# EAGLE schematic schematic (EAGLE 7.5.0)
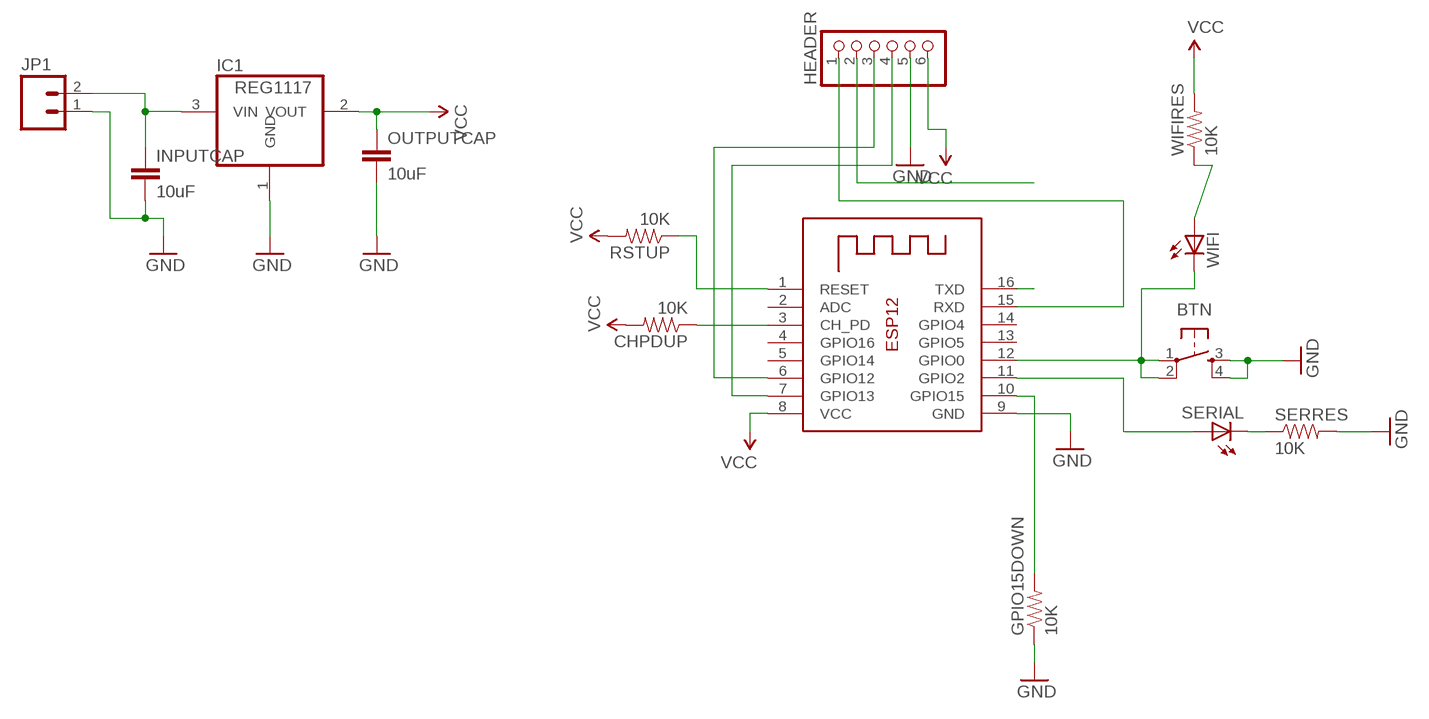
[diagram p0: schematic, sheet 1]

## Parts
BTN  TAC_SWITCHPTH  [TACTILE-PTH]
CHPDUP  10K  RESISTOR0805-RES  [0805]
GPIO15DOWN  10K  RESISTOR0805-RES  [0805]
HEADER  PINHD-1X6  [1X06]
IC1  REG1117  [SOT223]
INPUTCAP  10uF  CAP0805  [0805]
JP1  M02LOCK  [1X02_LOCK]
OUTPUTCAP  10uF  CAP0805  [0805]
RSTUP  10K  RESISTOR0805-RES  [0805]
SERIAL  LEDCHIPLED_0805  [CHIPLED_0805]
SERRES  10K  RESISTOR0805-RES  [0805]
WIFI  LEDCHIPLED_0805  [CHIPLED_0805]
WIFIRES  10K  RESISTOR0805-RES  [0805]
X1  ESP-12  [ESP-12]

## Nets
GND: BTN.3 BTN.4 GPIO15DOWN.1 HEADER.5 IC1.1(GND) INPUTCAP.2 JP1.1 OUTPUTCAP.2 SERRES.2 X1.9(GND)
N$1: HEADER.1 X1.15(RXD)
N$2: HEADER.2
N$3: HEADER.3 X1.6(GPIO12)
N$4: HEADER.4 X1.7(GPIO13)
N$5: BTN.1 BTN.2 WIFI.C X1.12(GPIO0)
N$6: SERIAL.C SERRES.1
N$7: X1.16(TXD)
N$8: CHPDUP.1 X1.3(CH_PD)
N$9: SERIAL.A X1.11(GPIO2)
N$10: GPIO15DOWN.2 X1.10(GPIO15)
N$11: RSTUP.1 X1.1(RESET)
N$12: IC1.3(VIN) INPUTCAP.1 JP1.2
N$13: WIFI.A WIFIRES.1
VCC: CHPDUP.2 HEADER.6 IC1.2(VOUT) OUTPUTCAP.1 RSTUP.2 WIFIRES.2 X1.8(VCC)
Unconnected: X1.2(ADC) X1.4(GPIO16) X1.5(GPIO14) X1.13(GPIO5) X1.14(GPIO4)

## Library data of the parts
BTN = SparkFun-Retired:TAC_SWITCH: Momentary Switch Button commonly used for reset or general input. Spark Fun Electronics SKU : COM-00097 SMT- SWCH-08247
CHPDUP GPIO15DOWN RSTUP SERRES WIFIRES = SparkFun-Passives:RESISTOR: Resistor Basic schematic elements and footprints for 0603, 1206, and PTH resistors.
HEADER = adafruit:PINHD-1X6: PIN HEADER
IC1 = 1117:REG1117: 800mA and 1A Low Dropout (LDO) Positive Regulator 1.8V, 2.5V, 2.85V, 3.3V, 5V, and Adj; MPN: REG1117; OC_FARNELL: 1097566; OC_NEWARK: 14P6981
INPUTCAP OUTPUTCAP = SparkFun-Passives:CAP: Capacitor Standard 0603 ceramic capacitor, and 0.1" leaded capacitor.
JP1 = SparkFun-Connectors:M02: Standard 2-pin 0.1" header. Use with - straight break away headers ( PRT-00116) - right angle break away headers (PRT-00553) - swiss pins (PRT-00743) - machine pins (PRT-00117) - female headers (PRT-00115) Molex polarized connector foot print use with: PRT-08233 with associated crimp pins and housings. 2.54_SCREWTERM for use with PRT-10571. 3.5mm Screw Terminal footprints for PRT-08084 5mm Screw Terminal footprints for use with PRT-08432
SERIAL WIFI = adafruit:LED: LED OSRAM: - CHIPLED LG R971, LG N971, LY N971, LG Q971, LY Q971, LO R971, LY R971 LH N974, LH R974 LS Q976, LO Q976, LY Q976 LO Q996 - Hyper CHIPLED LW Q18S LB Q993, LB Q99A, LB R99A - SideLED LS A670, LO A670, LY A670, LG A670, LP A670 LB A673, LV A673, LT A673, LW A673 LH A674 LY A675 LS A676, LA A676, LO A676, LY A676, LW A676 LS A679, LY A679, LG A679 - Hyper Micro SIDELED® LS Y876, LA Y876, LO Y876, LY Y876 LT Y87S - SmartLED LW L88C, LW L88S LB L89C, LB L89S, LG L890 LS L89K, LO L89K, LY L89K LS L896, LA L896, LO L896, LY L896 - TOPLED LS T670, LO T670, LY T670, LG T670, LP T670 LSG T670, LSP T670, LSY T670, LOP T670, LYG T670 LG T671, LOG T671, LSG T671 LB T673, LV T673, LT T673, LW T673 LH T674 LS T676, LA T676, LO T676, LY T676, LB T676, LH T676, LSB T676, LW T676 LB T67C, LV T67C, LT T67C, LS T67K, LO T67K, LY T67K, LW E67C LS E67B, LA E67B, LO E67B, LY E67B, LB E67C, LV E67C, LT E67C LW T67C LS T679, LY T679, LG T679 LS T770, LO T770, LY T770, LG T770, LP T770 LB T773, LV T773, LT T773, LW T773 LH T774 LS E675, LA E675, LY E675, LS T675 LS T776, LA T776, LO T776, LY T776, LB T776 LHGB T686 LT T68C, LB T68C - Hyper Mini TOPLED® LB M676 - Mini TOPLED Santana® LG M470 LS M47K, LO M47K, LY M47K Source: http://www.osram.convergy.de/
X1 = adafruit:ESP-12